# EAGLE design telephon (EAGLE 6.6.0)
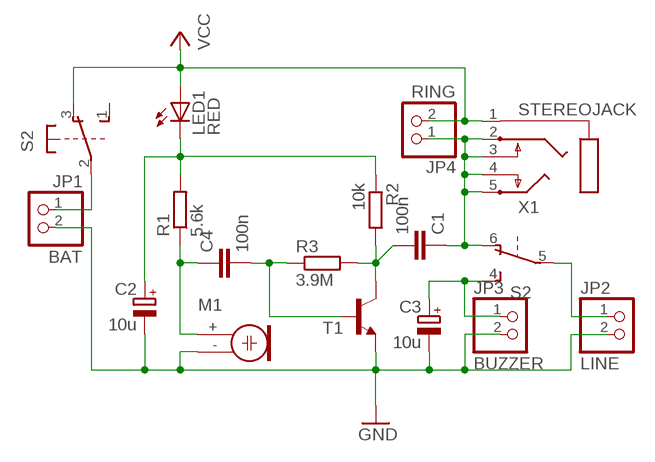
[diagram p0: schematic, sheet 1]

## Parts
C1  100n  C-EUC1206  [C1206]
C2  10u  CPOL-EUB45181A  [B45181A]
C3  10u  CPOL-EUB45181A  [B45181A]
C4  100n  C-EUC1206  [C1206]
JP1  BAT  PINHD-1X2  [1X02]
JP2  LINE  PINHD-1X2  [1X02]
JP3  BUZZER  PINHD-1X2  [1X02]
JP4  RING  PINHD-1X2  [1X02]
LED1  RED  LED5MM  [LED5MM]
M1  ELECTRET  [9.7ELECTRET]
R1  5.6k  R-EU_R1206  [R1206]
R2  10k  R-EU_R1206  [R1206]
R3  3.9M  R-EU_R1206  [R1206]
S2  9450-2  [9450-2]
T1  MMBT2222ALT1-NPN-SOT23-BEC  [SOT23-BEC]
X1  STEREOJACK  [STX3100]

## Nets
GND: C2.- C3.- JP1.2 JP2.2 JP3.2 M1.- T1.E
N$1: C3.+ JP3.1 S2.4(2:S)
N$4: C4.2 R3.1 T1.B
N$5: C4.1 M1.+ R1.1
N$6: C1.2 R2.2 R3.2 T1.C
N$8: C1.1 JP4.1 S2.6(2:O) X1.2 X1.3 X1.4 X1.5
N$9: C2.+ LED1.K(C) R1.2 R2.1
N$11: JP2.1 S2.5(2:P)
N$12: JP1.1 S2.2(1:P)
VCC: JP4.2 LED1.A S2.3(1:O) X1.1
Unconnected: S2.1(1:S)

## Library data of the parts
C1 C4 = resistor:C-EU: CAPACITOR, European symbol
C2 C3 = rcl:CPOL-EU: POLARIZED CAPACITOR, European symbol
JP1-JP4 = pinhead:PINHD-1X2: PIN HEADER
LED1 = led:LED: LED OSRAM: - CHIPLED LG R971, LG N971, LY N971, LG Q971, LY Q971, LO R971, LY R971 LH N974, LH R974 LS Q976, LO Q976, LY Q976 LO Q996 - Hyper CHIPLED LW Q18S LB Q993, LB Q99A, LB R99A - SideLED LS A670, LO A670, LY A670, LG A670, LP A670 LB A673, LV A673, LT A673, LW A673 LH A674 LY A675 LS A676, LA A676, LO A676, LY A676, LW A676 LS A679, LY A679, LG A679 - Hyper Micro SIDELED® LS Y876, LA Y876, LO Y876, LY Y876 LT Y87S - SmartLED LW L88C, LW L88S LB L89C, LB L89S, LG L890 LS L89K, LO L89K, LY L89K LS L896, LA L896, LO L896, LY L896 - TOPLED LS T670, LO T670, LY T670, LG T670, LP T670 LSG T670, LSP T670, LSY T670, LOP T670, LYG T670 LG T671, LOG T671, LSG T671 LB T673, LV T673, LT T673, LW T673 LH T674 LS T676, LA T676, LO T676, LY T676, LB T676, LH T676, LSB T676, LW T676 LB T67C, LV T67C, LT T67C, LS T67K, LO T67K, LY T67K, LW E67C LS E67B, LA E67B, LO E67B, LY E67B, LB E67C, LV E67C, LT E67C LW T67C LS T679, LY T679, LG T679 LS T770, LO T770, LY T770, LG T770, LP T770 LB T773, LV T773, LT T773, LW T773 LH T774 LS E675, LA E675, LY E675, LS T675 LS T776, LA T776, LO T776, LY T776, LB T776 LHGB T686 LT T68C, LB T68C - Hyper Mini TOPLED® LB M676 - Mini TOPLED Santana® LG M470 LS M47K, LO M47K, LY M47K Source: http://www.osram.convergy.de LUXEON: - LUMILED® LXK2-PW12-R00, LXK2-PW12-S00, LXK2-PW14-U00, LXK2-PW14-V00 LXK2-PM12-R00, LXK2-PM12-S00, LXK2-PM14-U00 LXK2-PE12-Q00, LXK2-PE12-R00, LXK2-PE12-S00, LXK2-PE14-T00, LXK2-PE14-U00 LXK2-PB12-K00, LXK2-PB12-L00, LXK2-PB12-M00, LXK2-PB14-N00, LXK2-PB14-P00, LXK2-PB14-Q00 LXK2-PR12-L00, LXK2-PR12-M00, LXK2-PR14-Q00, LXK2-PR14-R00 LXK2-PD12-Q00, LXK2-PD12-R00, LXK2-PD12-S00 LXK2-PH12-R00, LXK2-PH12-S00 LXK2-PL12-P00, LXK2-PL12-Q00, LXK2-PL12-R00 Source: www.luxeon.com KINGBRIGHT: KA-3528ASYC Source: www.kingbright.com
M1 = adafruit:ELECTRET: Electret microphone Thru hole 2.54mm spacing with 9.7mm diameter
R1-R3 = resistor:R-EU_: RESISTOR, European symbol
S2 = switch-misc:9450-2: MARQUARDT SWITCH
T1 = transistor-neu-to92:*-NPN-: NPN Transistror
X1 = adafruit:STEREOJACK: MIC/HEADPHONE JACK Stereo jack with two switches. Kycon STX3100, CUI SJ1-3555NG and/or 4UCon 05544

## Board
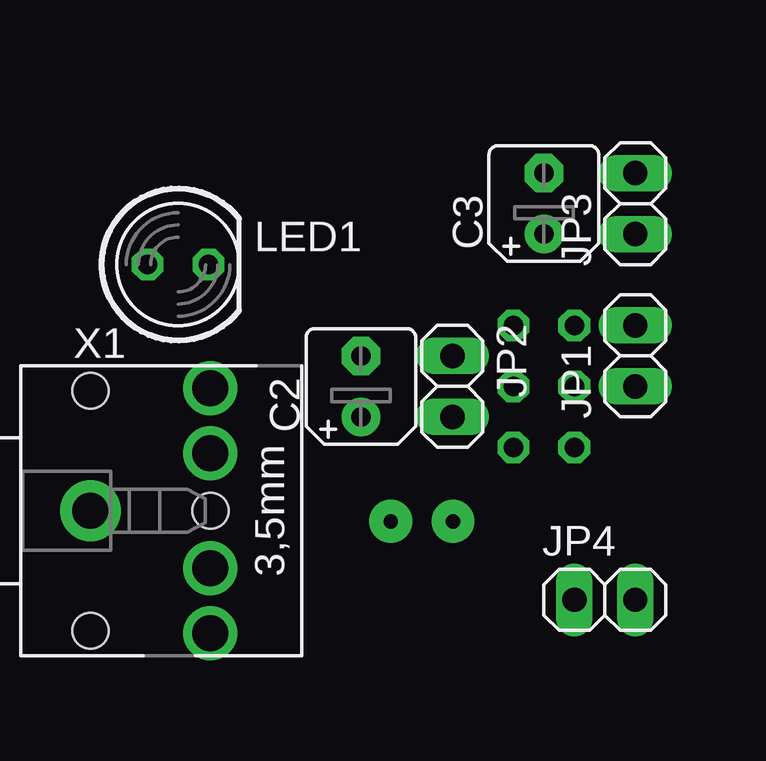
[diagram p1: board, top side]
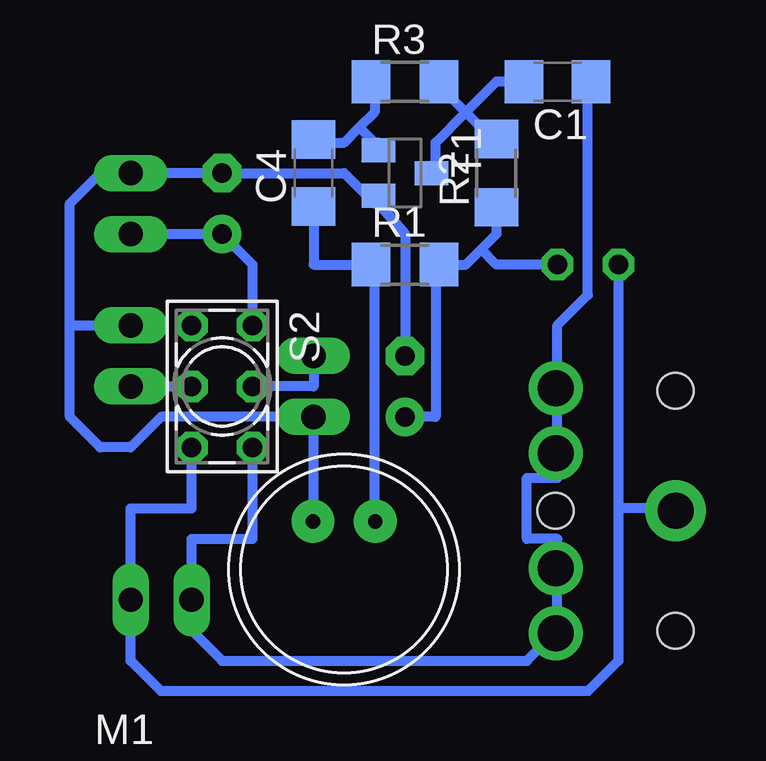
[diagram p2: board, bottom side, seen from below]

No outline drawn. Coordinates in mm, seen from the top.
Copper layers (1*16): Top 0.035mm / dielectric 1.5mm / Bottom 0.035mm
Design rules "default": minimum track width 10mil, minimum drill 24mil, track to track 8mil, track to pad 8mil, pad to pad 8mil, via to via 8mil, smd to smd 8mil, copper to edge 40mil, drill to drill 8mil, minimum pad ring 10mil, minimum via ring 8mil, stop-mask expansion 4mil, vias tented up to drill 0mil, thermal gap 10mil

### Footprints (pad centres in the part's own frame; a part is rotated, then mirrored left to right if it is on the bottom)
C1206 = smd 1.6 x 1.8: 1 -1.4,0; 2 1.4,0
B45181A = drill 0.813 pad 1.6: + -1.27,0 | drill 0.813 pad 1.6 octagon: - 1.27,0
1X02 = drill 1.016 long: 1 -1.27,0; 2 1.27,0
LED5MM = drill 0.813 octagon: A -1.27,0; K 1.27,0
9.7ELECTRET = drill 0.6 pad 1.778: + 1.3,2; - -1.3,2
R1206 = smd 1.6 x 1.803: 1 -1.422,0; 2 1.422,0
9450-2 = drill 0.813 octagon: 1 -2.54,-1.27; 2 0,-1.27; 3 2.54,-1.27; 4 -2.54,1.27; 5 0,1.27; 6 2.54,1.27
SOT23-BEC = smd 1 x 1.4: B -0.95,-1.1; C 0,1.1; E 0.95,-1.1
STX3100 = drill 1.5 pad 2.54: 1 2.7,-0.1 | drill 1.5: 2 7.7,5; 3 7.7,2.3; 4 7.7,-2.5; 5 7.7,-5.2 | hole 1.5: 2.7,4.9; 2.7,-5.1; 7.7,-0.1

### Placement (x,y rotation side)
C1  7.62,24.13 180 bottom
C2  13.97,11.43 90 top
C3  21.59,19.05 90 top
C4  17.78,20.32 90 bottom
JP1  25.4,12.7 90 top
JP2  17.78,11.43 270 top
JP3  25.4,19.05 90 top
JP4  24.13,2.54 0 top
LED1  6.35,16.51 0 top
M1  16.51,3.81 0 bottom
R1  13.97,16.51 0 bottom
R2  10.16,20.32 90 bottom
R3  13.97,24.13 0 bottom
S2  21.59,11.43 270 bottom
T1  13.97,20.32 270 bottom
X1  0,6.35 0 top

### Tracks (layer width: path | path; a pad name or v marks a point on that pad's centre or on a via)
GND
  Bottom 0.406: 27.94,13.97 27.94,19.05 26.67,20.32 JP3.2 C3.- 16.51,20.32 15.24,19.05 | M1.- 17.78,5.81 JP2.2 24.13,10.16 25.4,8.89 26.67,8.89 27.94,10.16 27.94,13.97 | 27.94,13.97 JP1.2 | 15.24,19.05 15.07,19.05 | 15.07,19.05 T1.E 15.24,19.37 15.24,19.05 | 15.07,19.05 13.97,17.78 C2.-
N$1
  Bottom 0.406: JP3.1 C3.+ 20.32,16.51 S2.4
N$4
  Bottom 0.406: T1.B 15.07,21.59 15.24,21.59 15.88,22.23 | 15.88,22.23 15.24,22.86 15.24,24.13 R3.1 | C4.2 17.78,21.59 16.51,21.59 15.88,22.23
N$5
  Bottom 0.406: C4.1 17.78,16.51 R1.1 15.24,16.51 15.24,5.81 M1.+
N$6
  Bottom 0.406: T1.C 12.7,20.32 12.7,21.59 11.43,22.86 | 11.43,22.86 12.7,24.13 R3.2 | R2.2 10.16,21.59 11.43,22.86 | C1.2 10.16,24.13 11.43,22.86
N$8
  Bottom 0.406: 7.62,1.27 8.89,0 21.59,0 22.86,1.27 JP4.1 22.86,5.08 20.32,5.08 S2.6 | 7.62,1.27 7.62,1.15 X1.5 | 7.62,1.27 7.62,3.85 | 7.62,3.85 7.62,5.08 8.89,5.08 8.89,7.62 7.62,7.62 7.62,8.65 | 7.62,8.65 7.62,11.35 | X1.4 7.62,3.85 | X1.3 7.62,8.65 | X1.2 7.62,11.35 | 7.62,11.35 7.62,13.97 6.35,15.24 6.35,24.13 C1.1
N$9
  Bottom 0.406: 10.16,19.05 R2.1 10.16,17.78 10.79,17.14 | 10.79,17.14 11.43,16.51 R1.2 12.7,16.51 12.7,10.16 C2.+ | LED1.K 10.16,16.51 10.79,17.14
N$11
  Bottom 0.406: JP2.1 17.78,11.43 S2.5
N$12
  Bottom 0.406: JP1.1 S2.2
VCC
  Bottom 0.406: S2.3 22.86,6.35 25.4,6.35 JP4.2 25.4,0 24.13,-1.27 6.35,-1.27 5.08,0 5.08,6.35 | X1.1 2.54,6.25 2.54,6.35 5.08,6.35 | LED1.A 5.08,6.35